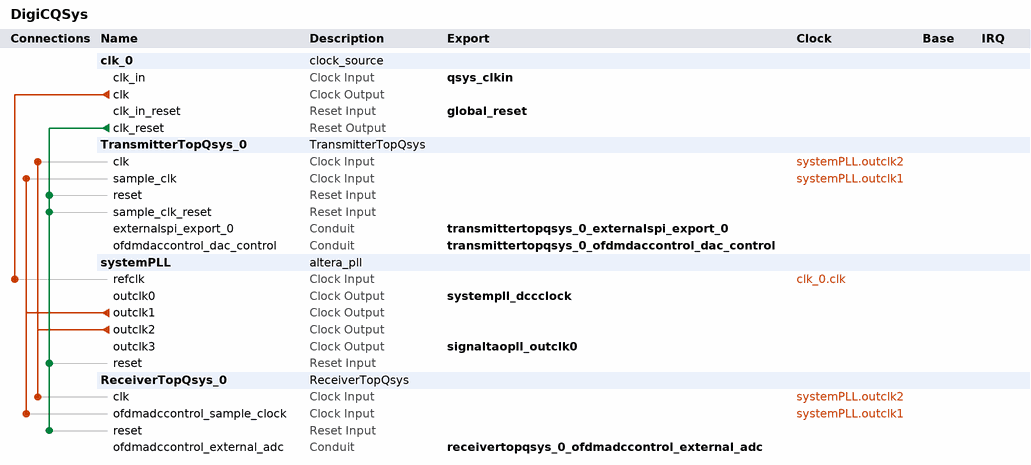
[diagram p0: system contents]
# Platform Designer (Qsys) system DigiCQSys, Cyclone V 5CSXFC6D6F31C6
# Parameters at their usual value, and those the tool derives, are not listed.
package require -exact qsys 16.1
create_system DigiCQSys
set_project_property DEVICE_FAMILY {Cyclone V}
set_project_property DEVICE 5CSXFC6D6F31C6

add_instance clk_0 clock_source 16.1
set_instance_parameter_value clk_0 clockFrequency 50000000

add_instance TransmitterTopQsys_0 TransmitterTopQsys 1.0

add_instance systemPLL altera_pll 16.1
set_instance_parameter_value systemPLL gui_actual_phase_shift3 {0.0 deg}
set_instance_parameter_value systemPLL gui_device_speed_grade 1
set_instance_parameter_value systemPLL gui_number_of_clocks 4
set_instance_parameter_value systemPLL gui_operation_mode direct
set_instance_parameter_value systemPLL gui_output_clock_frequency0 200.0
set_instance_parameter_value systemPLL gui_output_clock_frequency1 10.0
set_instance_parameter_value systemPLL gui_output_clock_frequency2 100.0
set_instance_parameter_value systemPLL gui_output_clock_frequency3 200.0
set_instance_parameter_value systemPLL gui_pll_mode {Fractional-N PLL}
set_instance_parameter_value systemPLL gui_reference_clock_frequency 50.0
set_instance_parameter_value systemPLL gui_use_locked false

add_instance ReceiverTopQsys_0 ReceiverTopQsys 1.0

# connections
add_connection clk_0.clk systemPLL.refclk clock
add_connection systemPLL.outclk1 ReceiverTopQsys_0.ofdmadccontrol_sample_clock clock
add_connection systemPLL.outclk1 TransmitterTopQsys_0.sample_clk clock
add_connection systemPLL.outclk2 ReceiverTopQsys_0.clk clock
add_connection systemPLL.outclk2 TransmitterTopQsys_0.clk clock
add_connection clk_0.clk_reset ReceiverTopQsys_0.reset reset
add_connection clk_0.clk_reset systemPLL.reset reset
add_connection clk_0.clk_reset TransmitterTopQsys_0.reset reset
add_connection clk_0.clk_reset TransmitterTopQsys_0.sample_clk_reset reset

# exported interfaces
add_interface global_reset reset sink
set_interface_property global_reset EXPORT_OF clk_0.clk_in_reset
add_interface qsys_clkin clock sink
set_interface_property qsys_clkin EXPORT_OF clk_0.clk_in
add_interface receivertopqsys_0_ofdmadccontrol_external_adc conduit end
set_interface_property receivertopqsys_0_ofdmadccontrol_external_adc EXPORT_OF ReceiverTopQsys_0.ofdmadccontrol_external_adc
add_interface signaltaopll_outclk0 clock source
set_interface_property signaltaopll_outclk0 EXPORT_OF systemPLL.outclk3
add_interface systempll_dccclock clock source
set_interface_property systempll_dccclock EXPORT_OF systemPLL.outclk0
add_interface transmittertopqsys_0_externalspi_export_0 conduit end
set_interface_property transmittertopqsys_0_externalspi_export_0 EXPORT_OF TransmitterTopQsys_0.externalspi_export_0
add_interface transmittertopqsys_0_ofdmdaccontrol_dac_control conduit end
set_interface_property transmittertopqsys_0_ofdmdaccontrol_dac_control EXPORT_OF TransmitterTopQsys_0.ofdmdaccontrol_dac_control

set_interconnect_requirement {$system} qsys_mm.clockCrossingAdapter HANDSHAKE
set_interconnect_requirement {$system} qsys_mm.enableEccProtection FALSE
set_interconnect_requirement {$system} qsys_mm.insertDefaultSlave FALSE
set_interconnect_requirement {$system} qsys_mm.maxAdditionalLatency 1

save_system DigiCQSys.qsys
